# EAGLE schematic improved_circuit_rev5 (EAGLE 7.5.0)

## Sheet 1 of 7
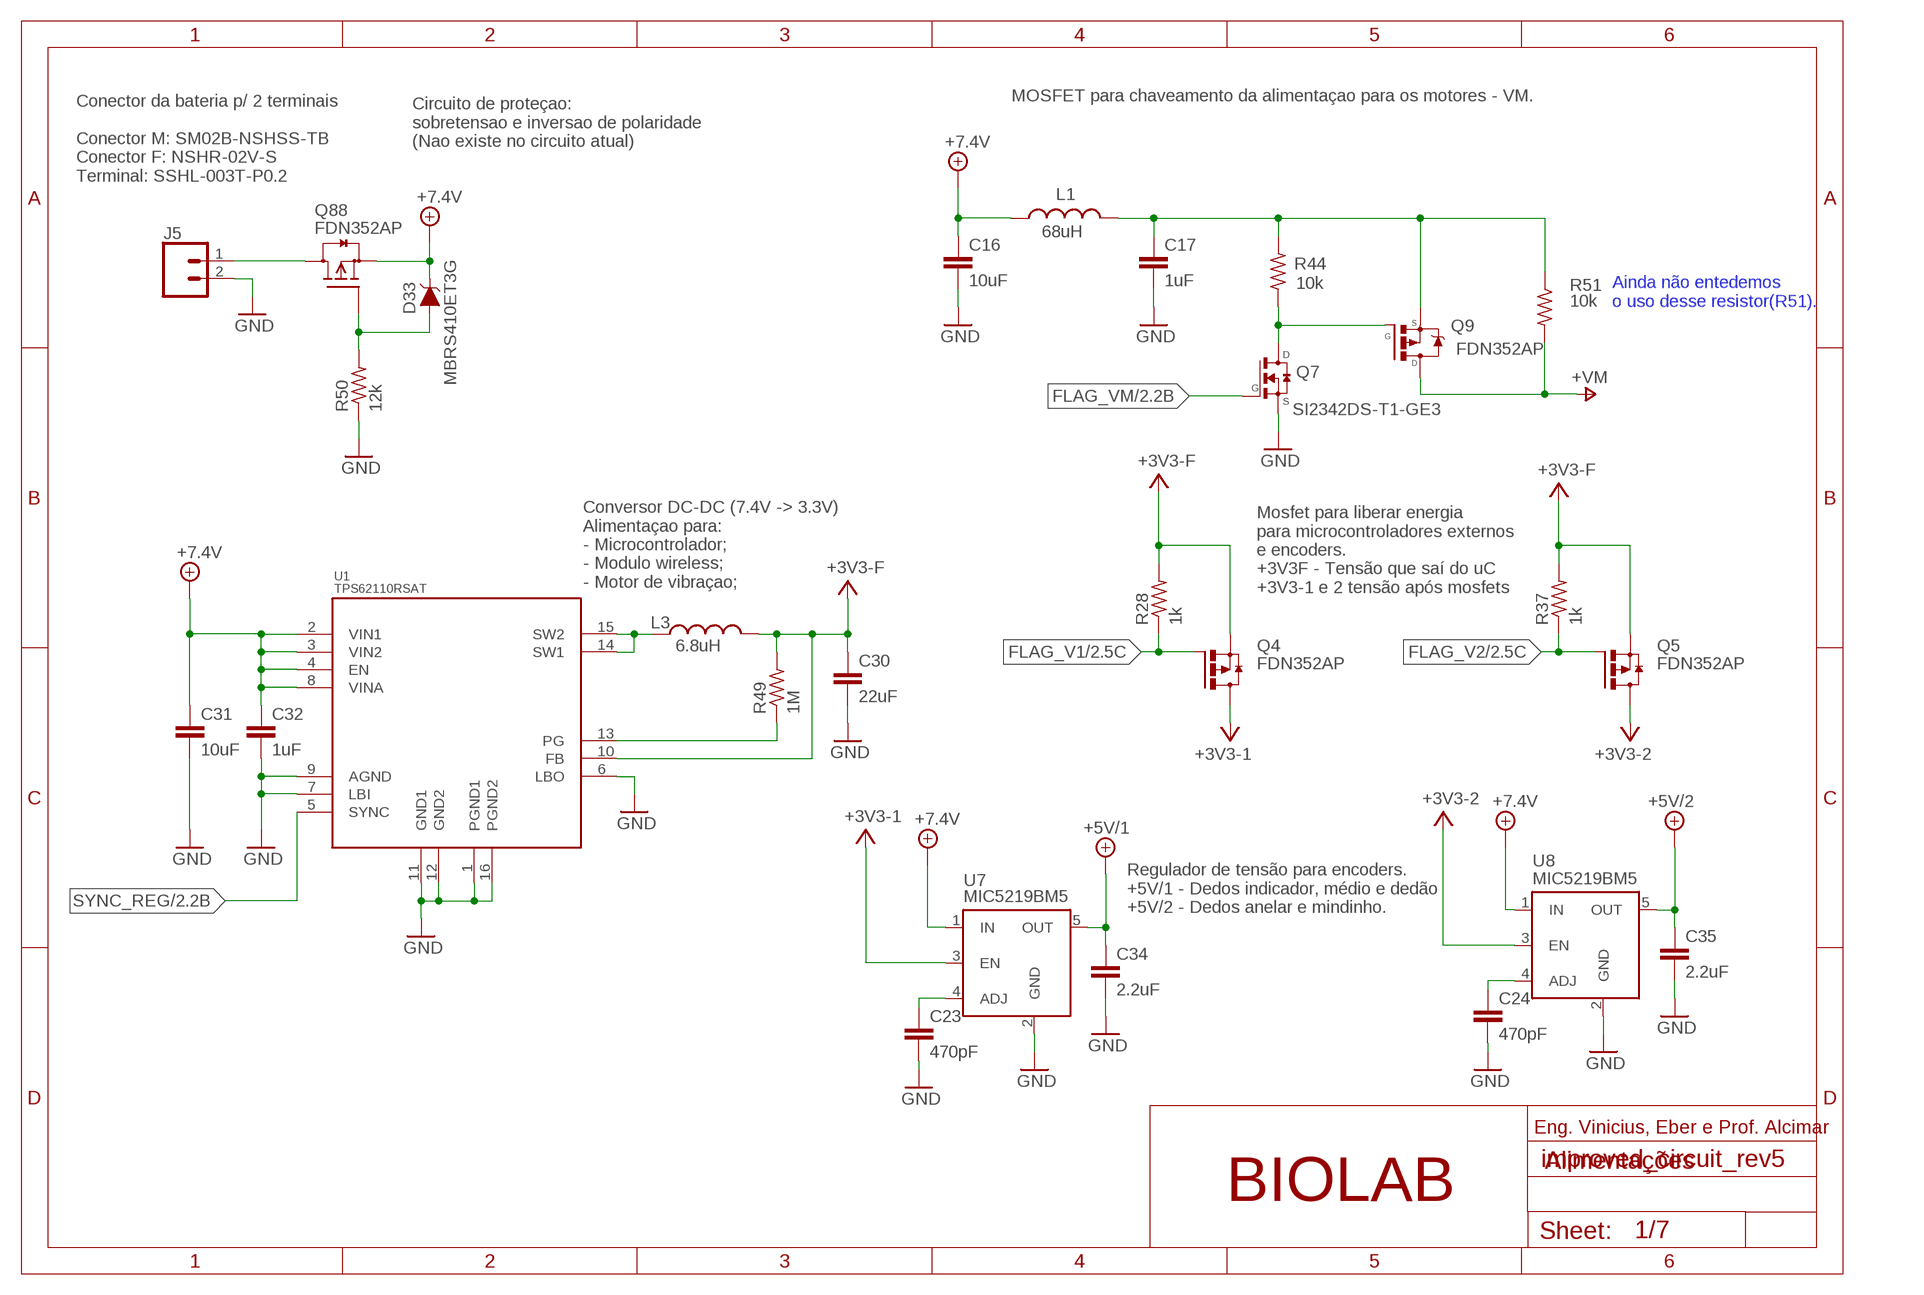
[diagram p0: schematic, sheet 1]

### Parts
C16  10uF  C-EUC0805  [C0805]
C17  1uF  C-EUC0805  [C0805]
C23  470pF  CAPACITOR_0805_M  [RESC0805_M]
C24  470pF  CAPACITOR_0805_M  [RESC0805_M]
C30  22uF  CAPACITOR_0805_M  [RESC0805_M]
C31  10uF  CAPACITOR_0805_M  [RESC0805_M]
C32  1uF  CAPACITOR_0805_M  [RESC0805_M]
C34  2.2uF  CAPACITOR_0805_M  [RESC0805_M]
C35  2.2uF  CAPACITOR_0805_M  [RESC0805_M]
D33  MBRS410ET3G  DIODE-ZENER-BZT52C3V6S  [SOD-323]
J5  CONN_02-JST-2MM-SMT  [JST-2-SMD]
L1  68uH  INDUCTOR  [L0603]
L3  6.8uH  INDUCTOR  [L0603]
Q4  FDN352AP  FDN360P  [SUPER-SOT3]
Q5  FDN352AP  FDN360P  [SUPER-SOT3]
Q7  SI2342DS-T1-GE3  FDV303N  [SOT23]
Q9  FDN352AP  FDS6675  [SO08-E3]
Q88  FDN352AP  BSS84LT1  [SOT23]
R28  1k  R-US_M0805  [M0805]
R37  1k  R-US_M0805  [M0805]
R44  10k  R-US_M0805  [M0805]
R49  1M  R-US_M0805  [M0805]
R50  12k  R-US_M0805  [M0805]
R51  10k  R-US_M0805  [M0805]
U1  TPS62110RSAT  [QFN16]
U7  MIC5219BM5  [SOT23-5]
U8  MIC5219BM5  [SOT23-5]

### Nets
+3V3: C30.1 L3.2 Q4.2(S) Q5.2(S) R28.2 R37.2 R49.2 U1.10(FB) U7.3(EN) U8.3(EN) ; supply symbol labelled +3V3-F, +3V3-1, +3V3-2 ; also sheet 2,3,5,6,7
+3V3-1: Q4.3(D) ; also sheet 4
+3V3-2: Q5.3(D) ; also sheet 4
+5V/1: C34.1 U7.5(OUT) ; also sheet 3,4
+5V/2: C35.1 U8.5(OUT) ; also sheet 4
+7V: C16.1 C31.1 C32.1 D33.C L1.1 Q88.2(S) U1.2(VIN1) U1.3(VIN2) U1.4(EN) U1.8(VINA) U7.1(IN) U8.1(IN) ; supply symbol labelled +7.4V ; also sheet 2
FLAG_V1: Q4.1(G) R28.1 ; also sheet 2
FLAG_V2: Q5.1(G) R37.1 ; also sheet 2
FLAG_VM: Q7.1(G) ; also sheet 2
GND: C16.2 C17.2 C23.2 C24.2 C30.2 C31.2 C32.2 C34.2 C35.2 J5.2 Q7.2(S) R50.1 U1.1(PGND1) U1.6(LBO) U1.7(LBI) U1.9(AGND) U1.11(GND1) U1.12(GND2) U1.16(PGND2) U7.2(GND) U8.2(GND) ; also sheet 2,3,4,5,6,7
N$9: C17.1 L1.2 Q9.1-3(S) R44.2 R51.1
N$10: Q7.3(D) Q9.4(G) R44.1
N$11: C24.1 U8.4(ADJ)
N$12: C23.1 U7.4(ADJ)
N$14: L3.1 U1.14(SW1) U1.15(SW2)
N$15: R49.1 U1.13(PG)
N$16: D33.A Q88.1(G) R50.2
N$18: J5.1 Q88.3(D)
SYNC_REG: U1.5(SYNC) ; also sheet 2
V+: Q9.5-8(D) R51.2 ; supply symbol labelled +VM ; also sheet 3,4,5

### Notes on the sheet
- MOSFET para chaveamento da alimentaçao para os motores - VM.
- Circuito de proteçao: 
  sobretensao e inversao de polaridade
  (Nao existe no circuito atual)
- Conector da bateria p/ 2 terminais
  
  Conector M: SM02B-NSHSS-TB
  Conector F: NSHR-02V-S
  Terminal: SSHL-003T-P0.2
- Ainda não entedemos 
  o uso desse resistor(R51).
- Conversor DC-DC (7.4V -> 3.3V) 
  Alimentaçao para:
  - Microcontrolador;
  - Modulo wireless;
  - Motor de vibraçao;
- Mosfet para liberar energia 
  para microcontroladores externos
  e encoders.
  +3V3F - Tensão que saí do uC
  +3V3-1 e 2 tensão após mosfets
- Regulador de tensão para encoders.
  +5V/1 - Dedos indicador, médio e dedão
  +5V/2 - Dedos anelar e mindinho.
- Eng. Vinicius, Eber e Prof. Alcimar
- Alimentações
- BIOLAB

## Sheet 2 of 7
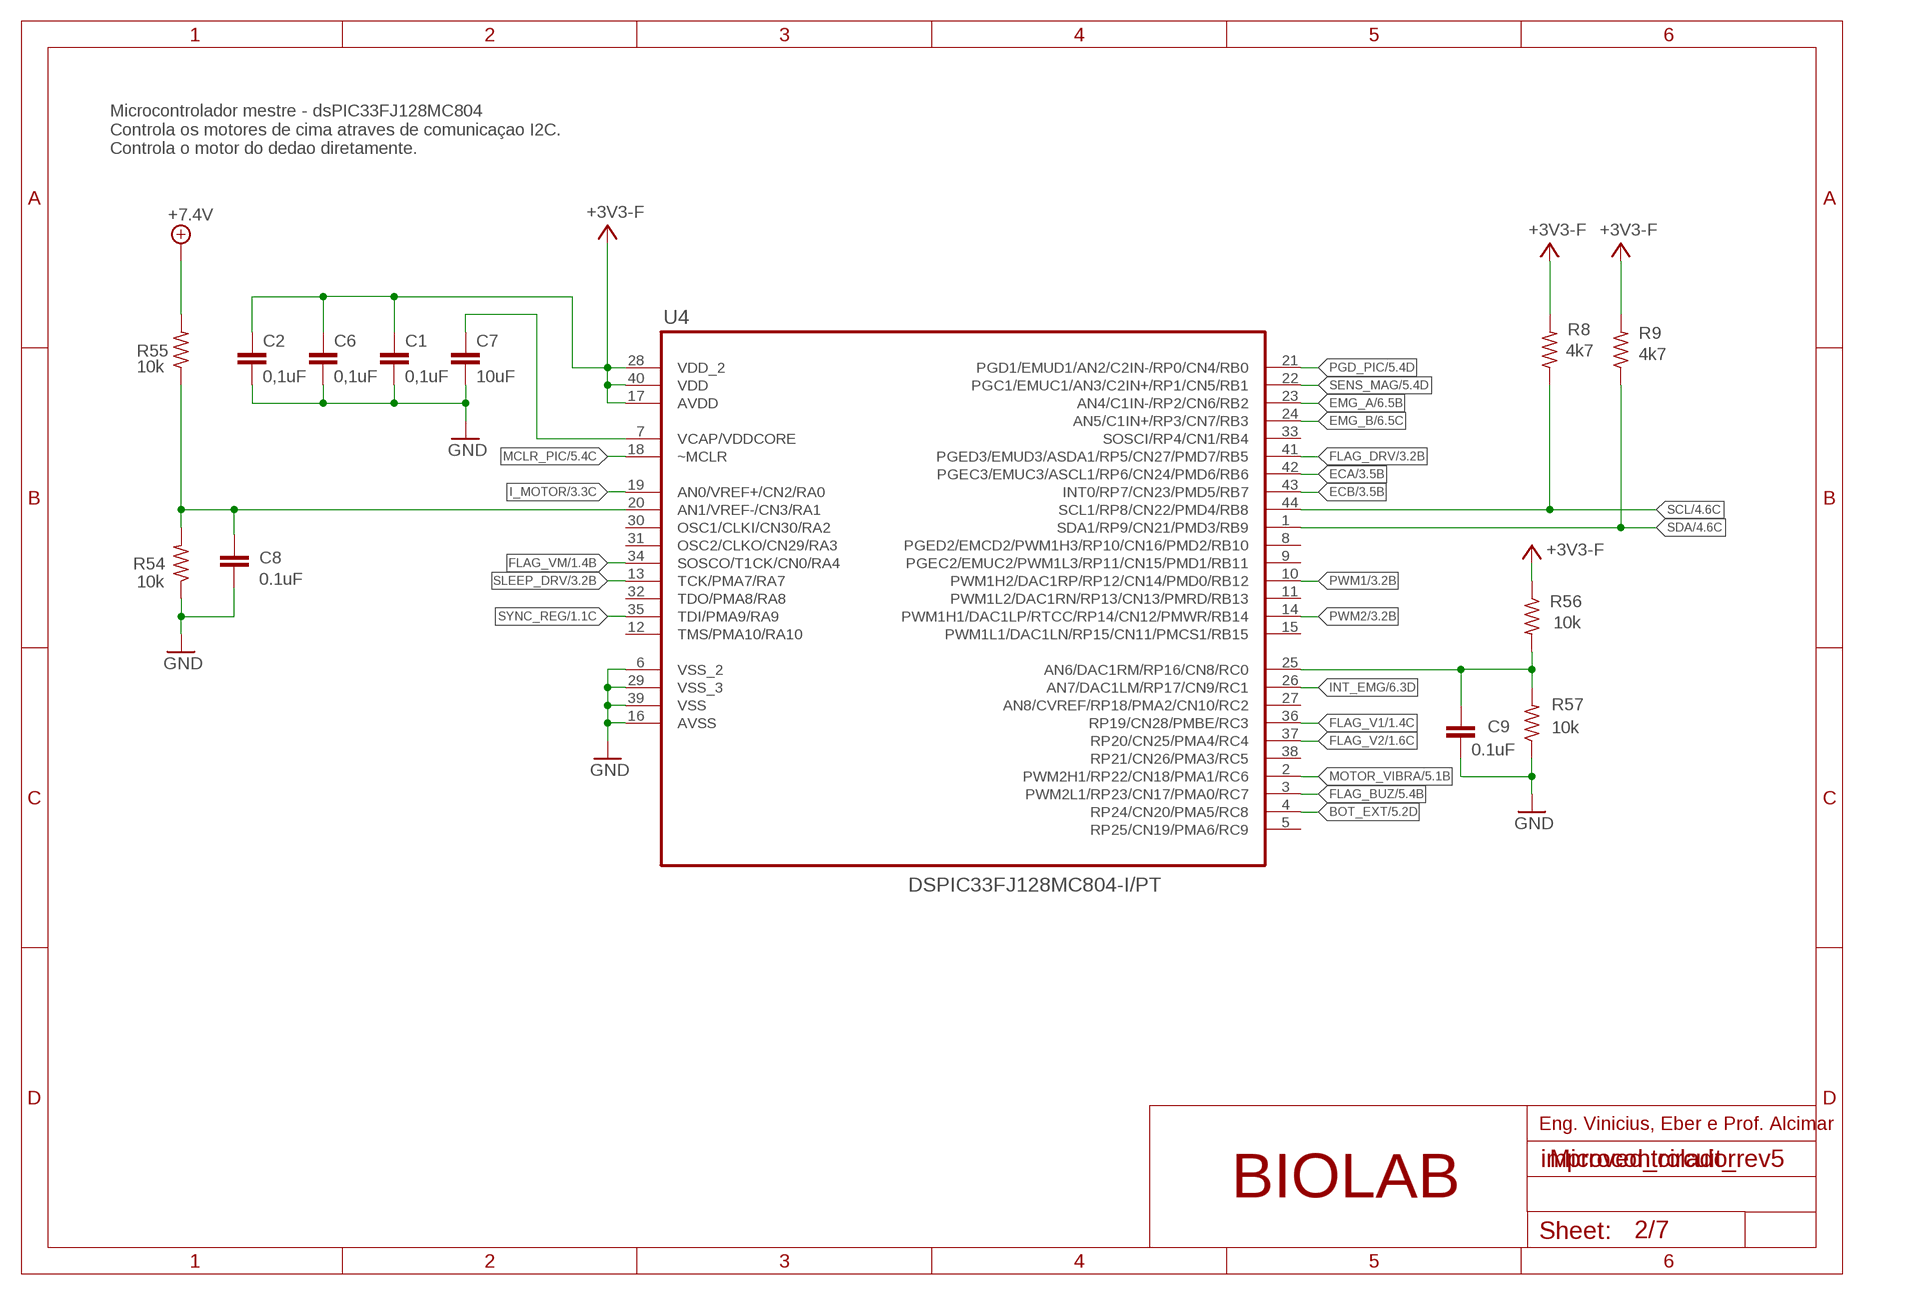
[diagram p1: schematic, sheet 2]

### Parts
C1  0,1uF  CAPACITOR_0805_M  [RESC0805_M]
C2  0,1uF  CAPACITOR_0805_M  [RESC0805_M]
C6  0,1uF  CAPACITOR_0805_M  [RESC0805_M]
C7  10uF  CAPACITOR_0805_M  [RESC0805_M]
C8  0.1uF  CAPACITOR_0805_M  [RESC0805_M]
C9  0.1uF  CAPACITOR_0805_M  [RESC0805_M]
R8  4k7  R-US_M0805  [M0805]
R9  4k7  R-US_M0805  [M0805]
R54  10k  R-US_M0805  [M0805]
R55  10k  R-US_M0805  [M0805]
R56  10k  R-US_M0805  [M0805]
R57  10k  R-US_M0805  [M0805]
U4  DSPIC33FJ128MC804-I/PT  [QFP80P1200X1200X120-44N]

### Nets
+3V3: C1.1 C2.1 C6.1 R8.2 R9.2 R56.1 U4.17(AVDD) U4.28(VDD_2) U4.40(VDD) ; supply symbol labelled +3V3-F ; also sheet 1,3,5,6,7
+7V: R55.2 ; supply symbol labelled +7.4V ; also sheet 1
BOT_EXT: U4.4(RP24/CN20/PMA5/RC8) ; also sheet 5
ECA: U4.42(PGEC3/EMUC3/ASCL1/RP6/CN24/PMD6/RB6) ; also sheet 3
ECB: U4.43(INT0/RP7/CN23/PMD5/RB7) ; also sheet 3
EMG_A: U4.23(AN4/C1IN-/RP2/CN6/RB2) ; also sheet 6
EMG_B: U4.24(AN5/C1IN+/RP3/CN7/RB3) ; also sheet 6
FLAG_BUZ: U4.3(PWM2L1/RP23/CN17/PMA0/RC7) ; also sheet 5
FLAG_DRV: U4.41(PGED3/EMUD3/ASDA1/RP5/CN27/PMD7/RB5) ; also sheet 3
FLAG_V1: U4.36(RP19/CN28/PMBE/RC3) ; also sheet 1
FLAG_V2: U4.37(RP20/CN25/PMA4/RC4) ; also sheet 1
FLAG_VM: U4.34(SOSCO/T1CK/CN0/RA4) ; also sheet 1
GND: C1.2 C2.2 C6.2 C7.2 C8.2 C9.2 R54.1 R57.1 U4.6(VSS_2) U4.16(AVSS) U4.29(VSS_3) U4.39(VSS) ; also sheet 1,3,4,5,6,7
I_MOTOR: U4.19(AN0/VREF+/CN2/RA0) ; also sheet 3
INT_EMG: U4.26(AN7/DAC1LM/RP17/CN9/RC1) ; also sheet 6
MCLR_PIC: U4.18(~MCLR) ; also sheet 5
MOTOR_VIBRA: U4.2(PWM2H1/RP22/CN18/PMA1/RC6) ; also sheet 5
N$3: C7.1 U4.7(VCAP/VDDCORE)
N$4: C9.1 R56.2 R57.2 U4.25(AN6/DAC1RM/RP16/CN8/RC0)
N$19: C8.1 R54.2 R55.1 U4.20(AN1/VREF-/CN3/RA1)
PGD_PIC: U4.21(PGD1/EMUD1/AN2/C2IN-/RP0/CN4/RB0) ; also sheet 5
PWM1: U4.10(PWM1H2/DAC1RP/RP12/CN14/PMD0/RB12) ; also sheet 3
PWM2: U4.14(PWM1H1/DAC1LP/RTCC/RP14/CN12/PMWR/RB14) ; also sheet 3
SCL: R8.1 U4.44(SCL1/RP8/CN22/PMD4/RB8) ; also sheet 4,6
SDA: R9.1 U4.1(SDA1/RP9/CN21/PMD3/RB9) ; also sheet 4,6
SENS_MAG: U4.22(PGC1/EMUC1/AN3/C2IN+/RP1/CN5/RB1) ; also sheet 5
SLEEP_DRV: U4.13(TCK/PMA7/RA7) ; also sheet 3
SYNC_REG: U4.35(TDI/PMA9/RA9) ; also sheet 1
Unconnected: U4.5(RP25/CN19/PMA6/RC9) U4.8(PGED2/EMCD2/PWM1H3/RP10/CN16/PMD2/RB10) U4.9(PGEC2/EMUC2/PWM1L3/RP11/CN15/PMD1/RB11) U4.11(PWM1L2/DAC1RN/RP13/CN13/PMRD/RB13) U4.12(TMS/PMA10/RA10) U4.15(PWM1L1/DAC1LN/RP15/CN11/PMCS1/RB15) U4.27(AN8/CVREF/RP18/PMA2/CN10/RC2) U4.30(OSC1/CLKI/CN30/RA2) U4.31(OSC2/CLKO/CN29/RA3) U4.32(TDO/PMA8/RA8) U4.33(SOSCI/RP4/CN1/RB4) U4.38(RP21/CN26/PMA3/RC5)

### Notes on the sheet
- Microcontrolador mestre - dsPIC33FJ128MC804
  Controla os motores de cima atraves de comunicaçao I2C.
  Controla o motor do dedao diretamente.
- Eng. Vinicius, Eber e Prof. Alcimar
- Microcontrolador
- BIOLAB

## Sheet 3 of 7
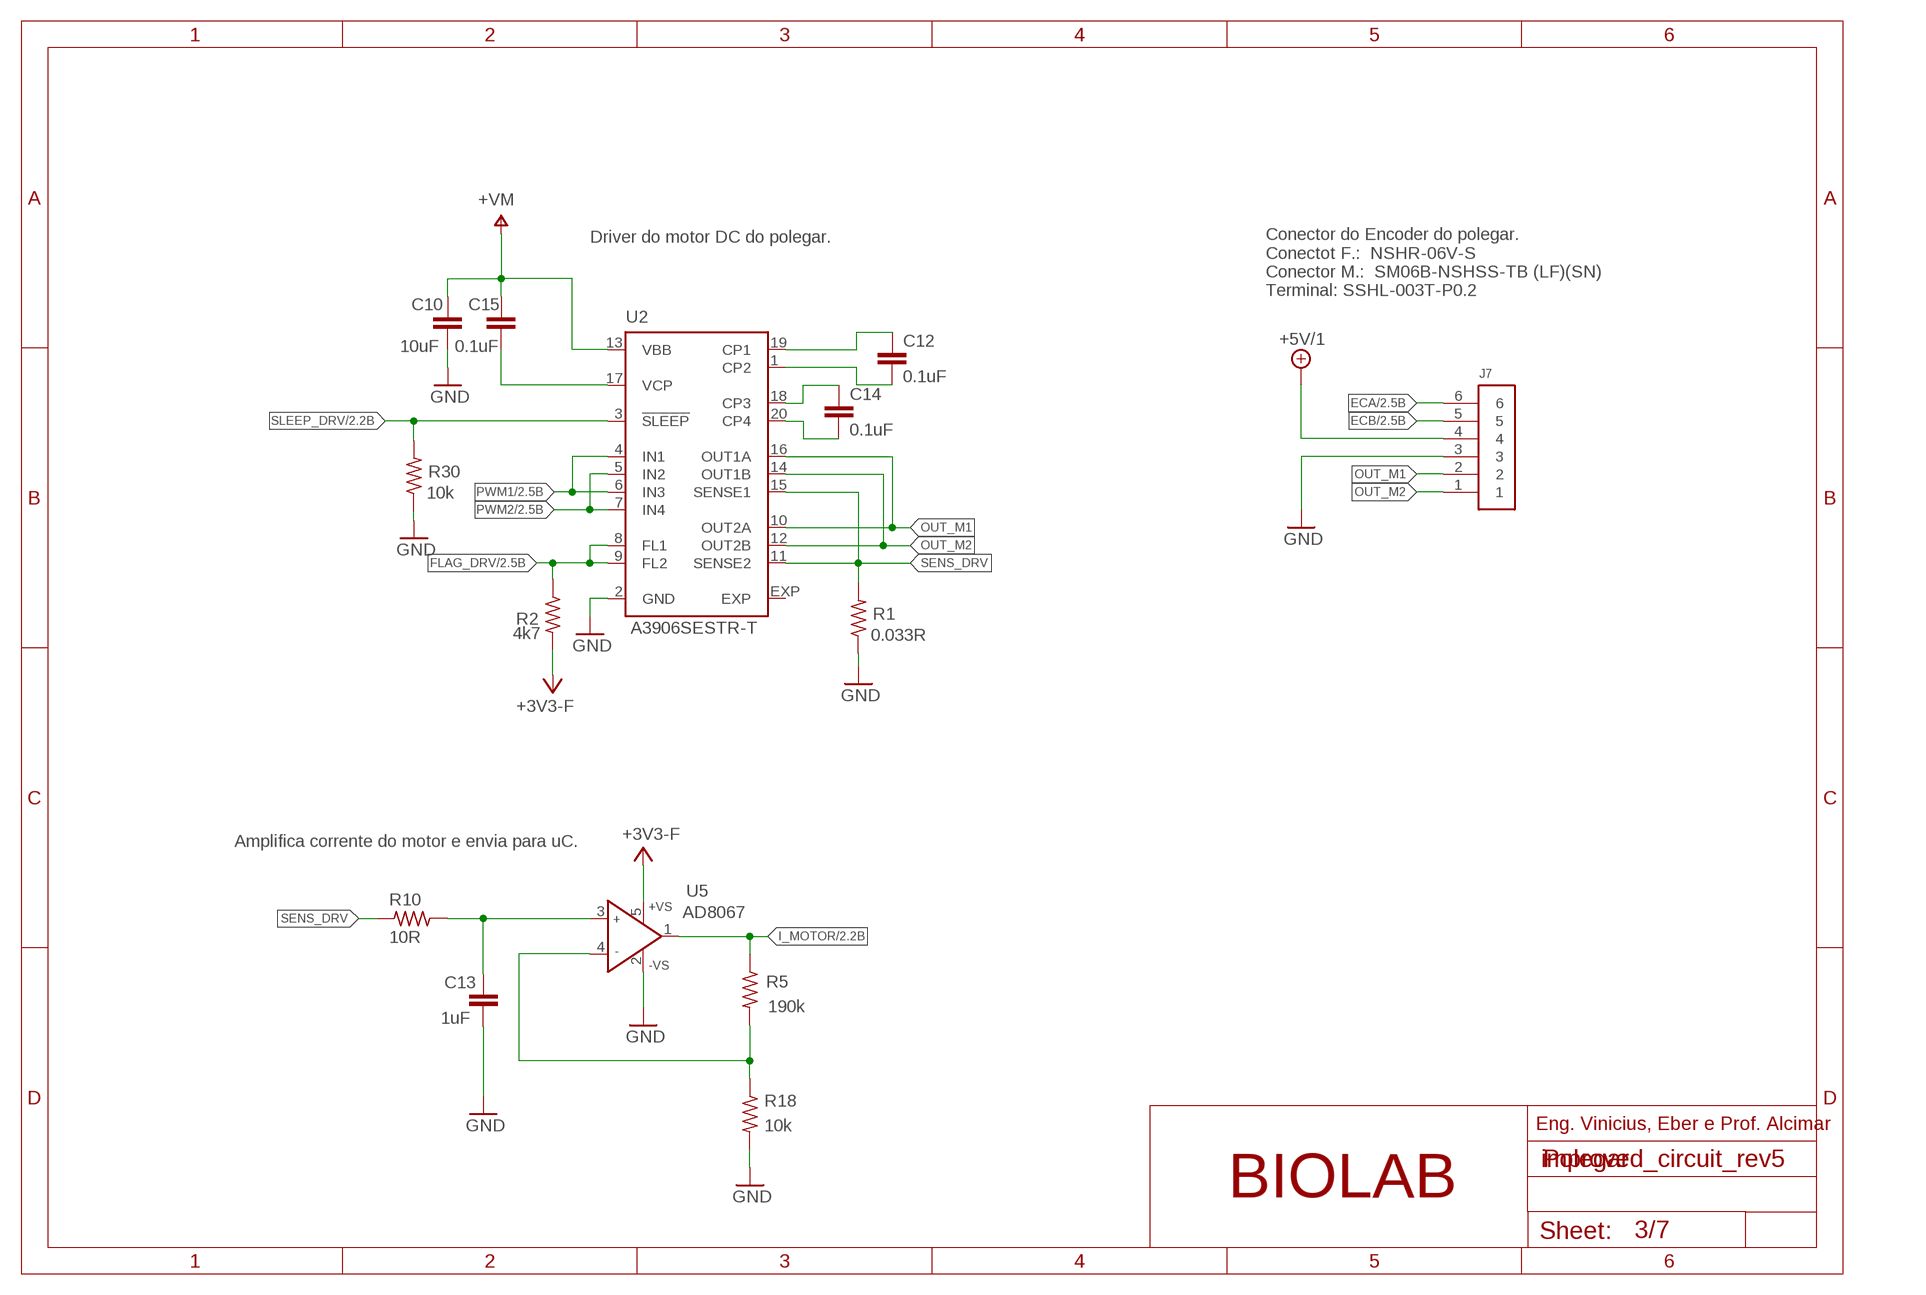
[diagram p2: schematic, sheet 3]

### Parts
C10  10uF  CAPACITOR_0805_M  [RESC0805_M]
C12  0.1uF  CAPACITOR_0805_M  [RESC0805_M]
C13  1uF  CAPACITOR_0805_M  [RESC0805_M]
C14  0.1uF  CAPACITOR_0805_M  [RESC0805_M]
C15  0.1uF  CAPACITOR_0805_M  [RESC0805_M]
J7  61300611121  [61300611121]
R1  0.033R  R-US_M0805  [M0805]
R2  4k7  R-US_M0805  [M0805]
R5  190k  R-US_R0805  [R0805]
R10  10R  R-US_R0805  [R0805]
R18  10k  R-US_R0805  [R0805]
R30  10k  R-US_M0805  [M0805]
U2  A3906SESTR-T  A3906  [QFN20]
U5  AD8067  [SOT23-5]

### Nets
+3V3: R2.2 U5.5(+VS) ; supply symbol labelled +3V3-F ; also sheet 1,2,5,6,7
+5V/1: J7.4 ; also sheet 1,4
ECA: J7.6 ; also sheet 2
ECB: J7.5 ; also sheet 2
FLAG_DRV: R2.1 U2.8(FL1) U2.9(FL2) ; also sheet 2
GND: C10.1 C13.2 J7.3 R1.1 R18.2 R30.1 U2.2(GND) U5.2(-VS) ; also sheet 1,2,4,5,6,7
I_MOTOR: R5.1 U5.1(OUT) ; also sheet 2
N$8: C13.1 R10.1 U5.3(IN+)
N$13: C12.2 U2.1(CP2)
N$17: C14.1 U2.18(CP3)
N$20: C15.2 U2.17(VCP)
N$21: C14.2 U2.20(CP4)
N$25: C12.1 U2.19(CP1)
N$26: R5.2 R18.1 U5.4(IN-)
OUT_M1: J7.2 U2.10(OUT2A) U2.16(OUT1A)
OUT_M2: J7.1 U2.12(OUT2B) U2.14(OUT1B)
PWM1: U2.4(IN1) U2.6(IN3) ; also sheet 2
PWM2: U2.5(IN2) U2.7(IN4) ; also sheet 2
SENS_DRV: R1.2 R10.2 U2.11(SENSE2) U2.15(SENSE1)
SLEEP_DRV: R30.2 U2.3(!SLEEP) ; also sheet 2
V+: C10.2 C15.1 U2.13(VBB) ; supply symbol labelled +VM ; also sheet 1,4,5
Unconnected: U2.EXP

### Notes on the sheet
- Driver do motor DC do polegar.
- Conector do Encoder do polegar.
  Conectot F.:  NSHR-06V-S 
  Conector M.:  SM06B-NSHSS-TB (LF)(SN) 
  Terminal: SSHL-003T-P0.2
- Amplifica corrente do motor e envia para uC.
- Eng. Vinicius, Eber e Prof. Alcimar
- Polegar
- BIOLAB

## Sheet 4 of 7
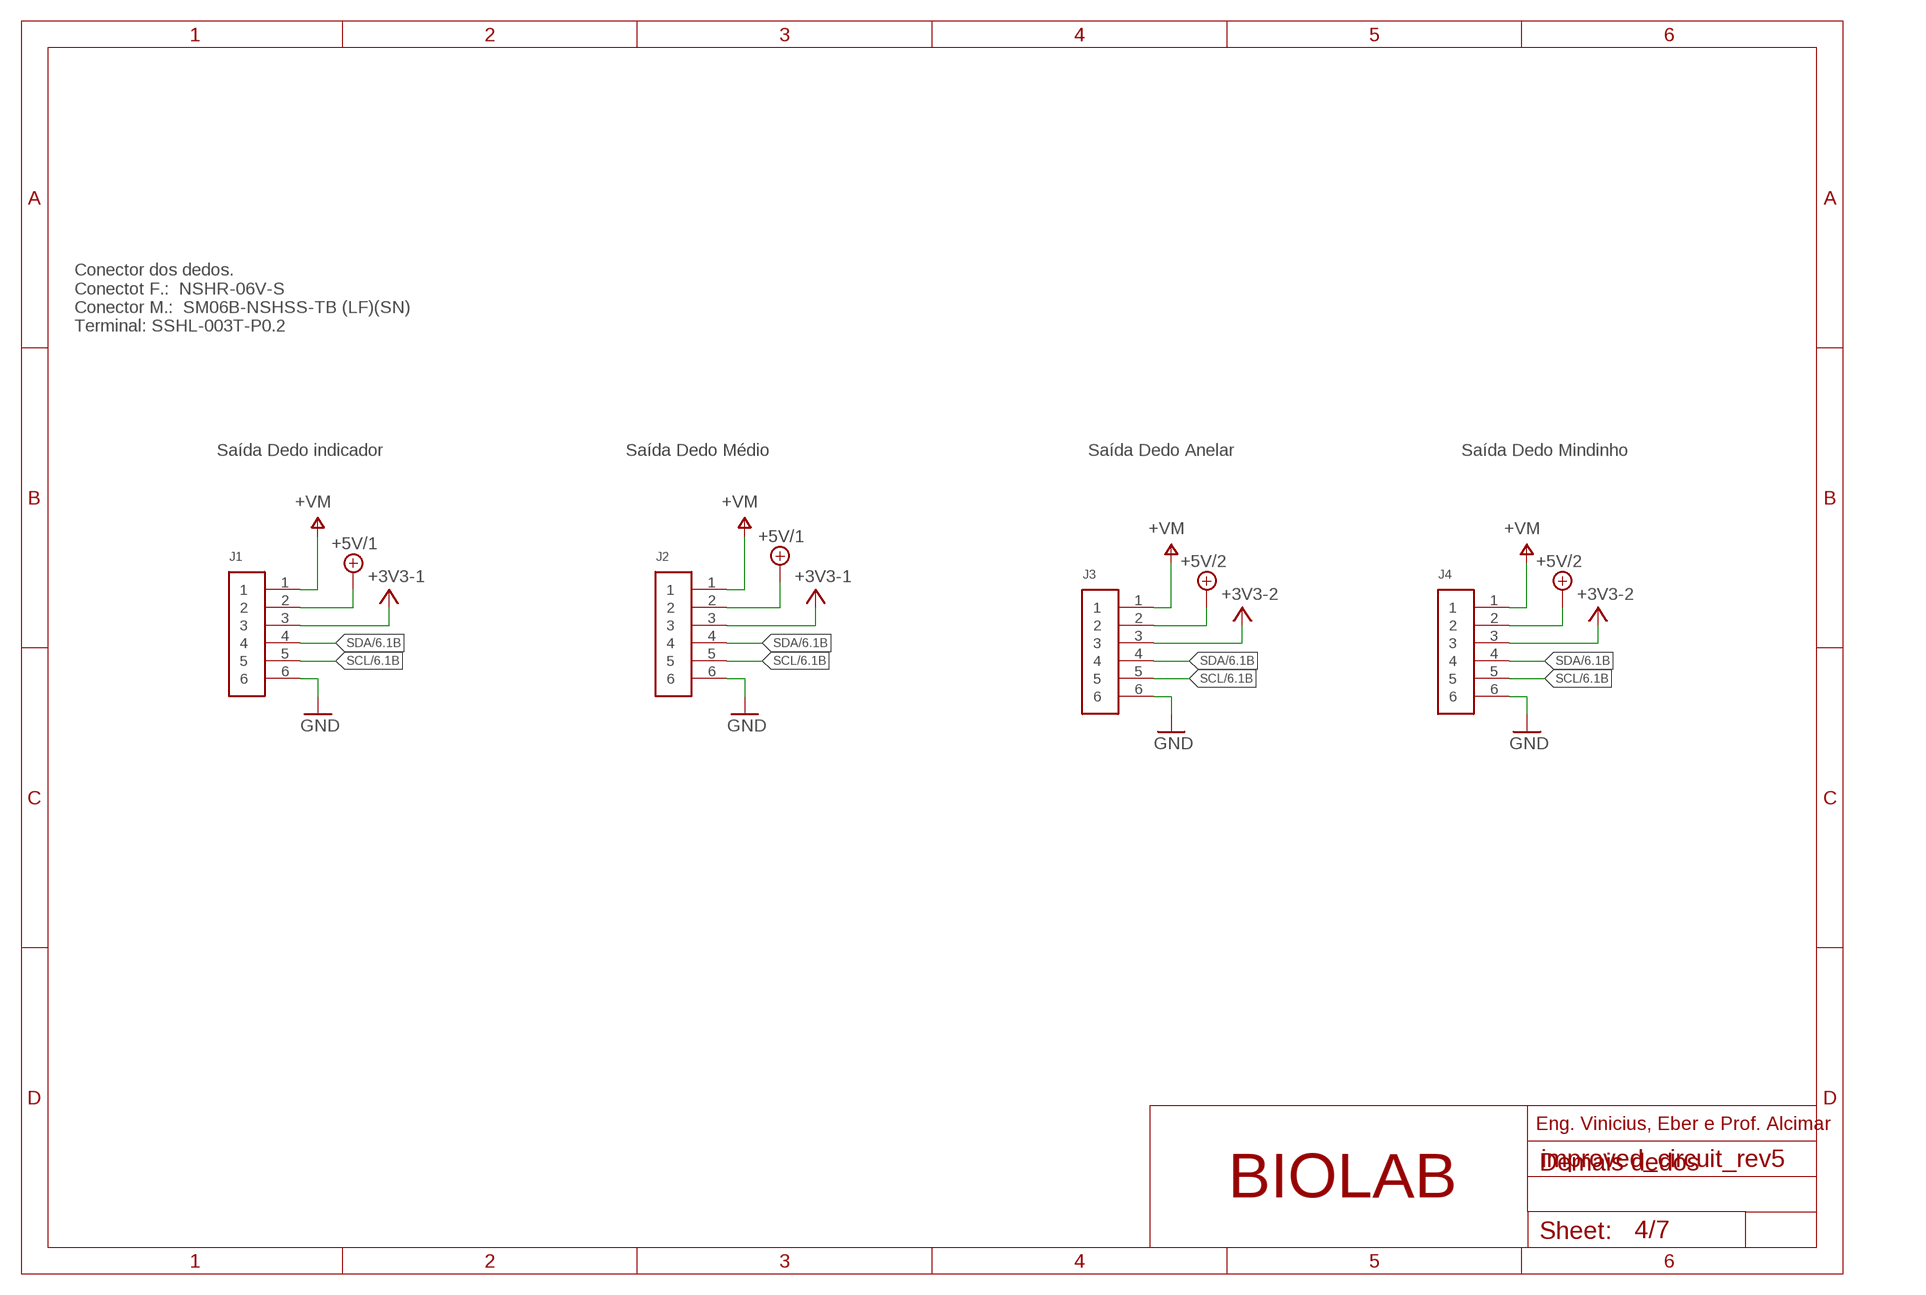
[diagram p3: schematic, sheet 4]

### Parts
J1  61300611121  [61300611121]
J2  61300611121  [61300611121]
J3  61300611121  [61300611121]
J4  61300611121  [61300611121]

### Nets
+3V3-1: J1.3 J2.3 ; also sheet 1
+3V3-2: J3.3 J4.3 ; also sheet 1
+5V/1: J1.2 J2.2 ; also sheet 1,3
+5V/2: J3.2 J4.2 ; also sheet 1
GND: J1.6 J2.6 J3.6 J4.6 ; also sheet 1,2,3,5,6,7
SCL: J1.5 J2.5 J3.5 J4.5 ; also sheet 2,6
SDA: J1.4 J2.4 J3.4 J4.4 ; also sheet 2,6
V+: J1.1 J2.1 J3.1 J4.1 ; supply symbol labelled +VM ; also sheet 1,3,5

### Notes on the sheet
- Conector dos dedos.
  Conectot F.:  NSHR-06V-S 
  Conector M.:  SM06B-NSHSS-TB (LF)(SN) 
  Terminal: SSHL-003T-P0.2
- Saída Dedo indicador | Saída Dedo Médio | Saída Dedo Anelar | Saída Dedo Mindinho
- Eng. Vinicius, Eber e Prof. Alcimar
- Demais dedos
- BIOLAB

## Sheet 5 of 7
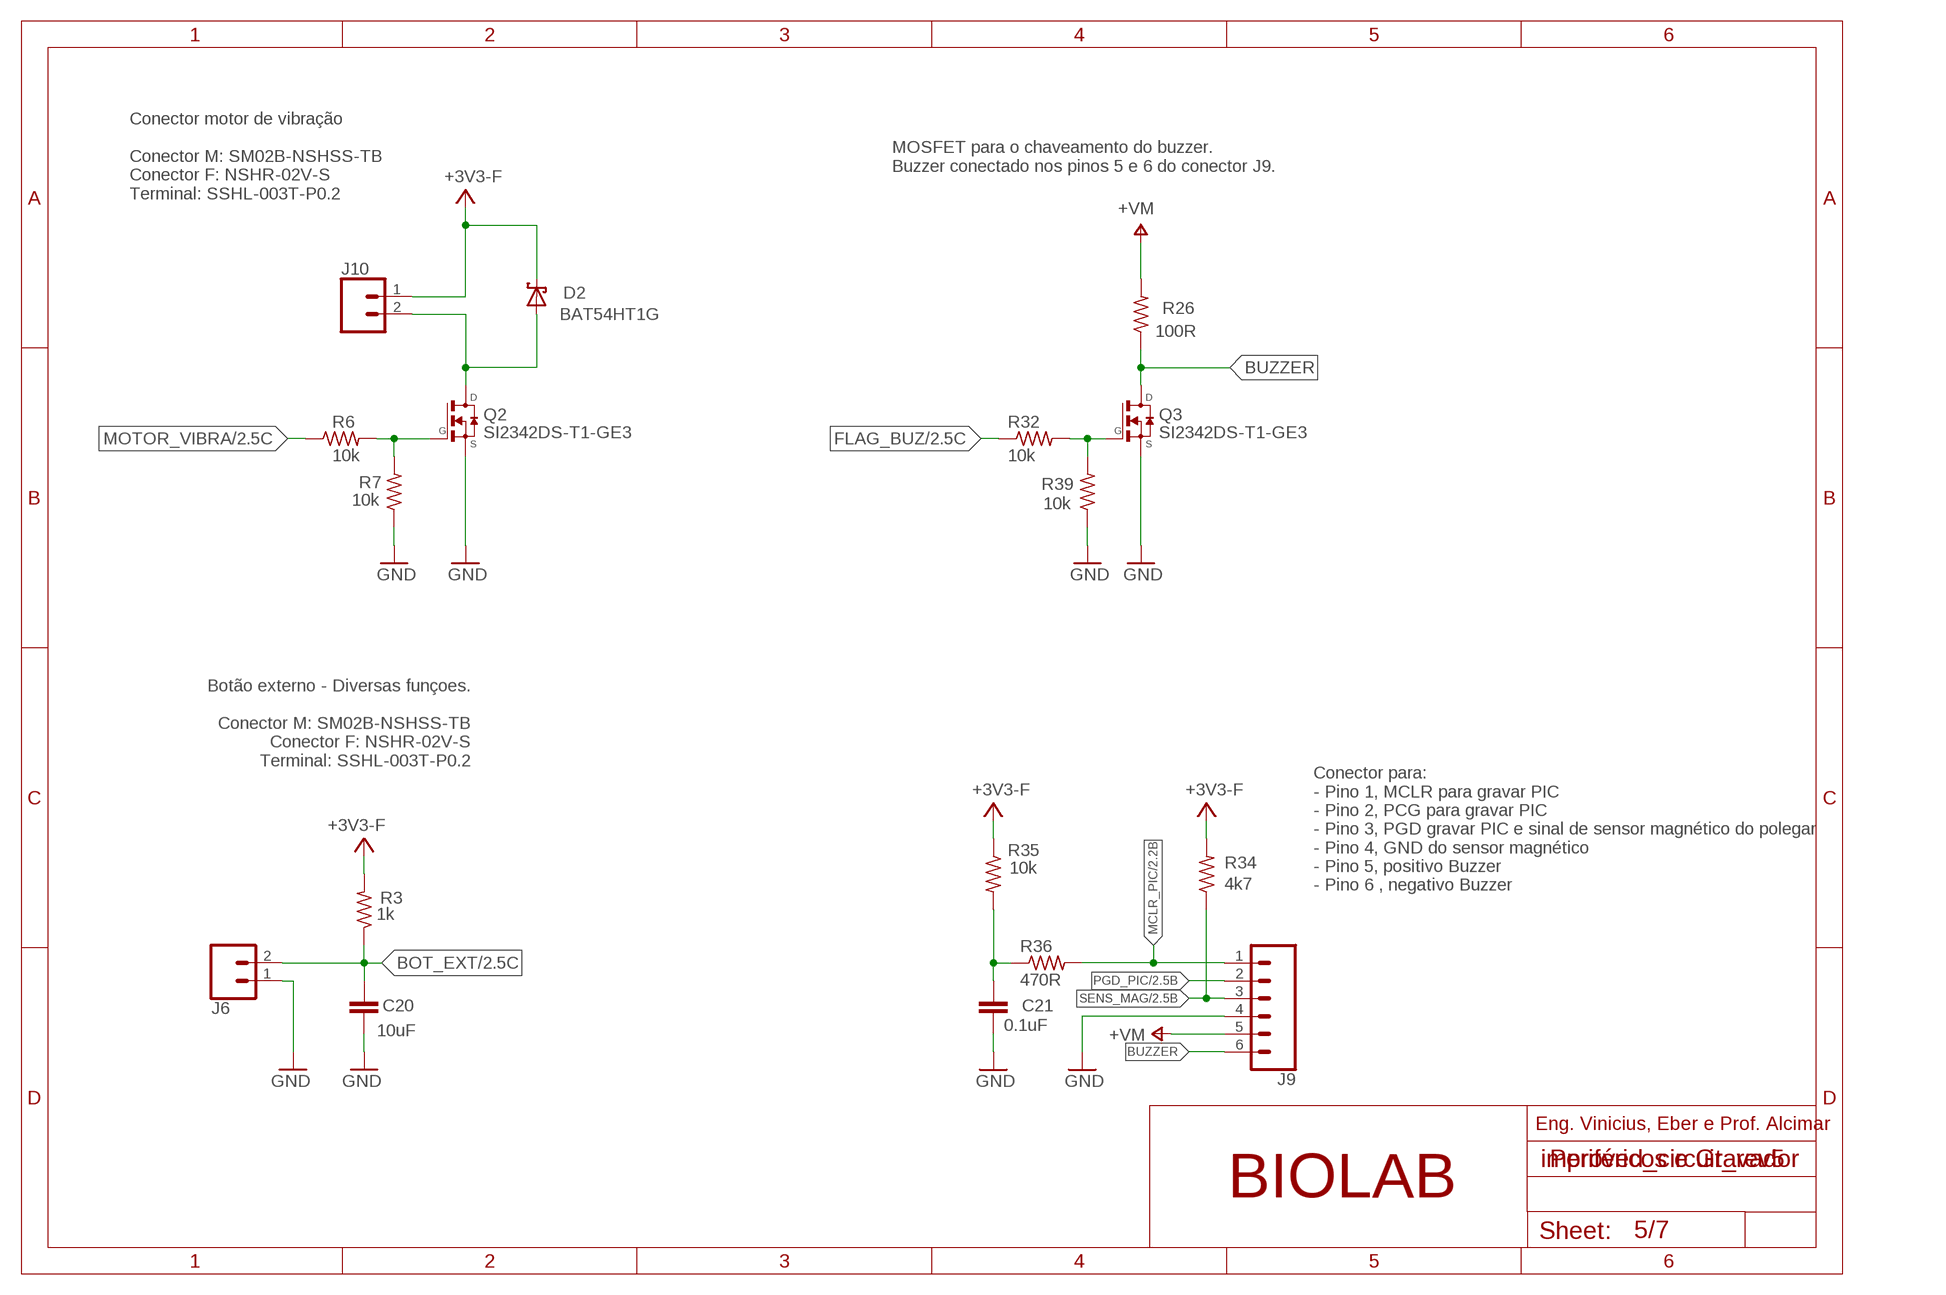
[diagram p4: schematic, sheet 5]

### Parts
C20  10uF  CAPACITOR_0805_M  [RESC0805_M]
C21  0.1uF  CAPACITOR_0805_M  [RESC0805_M]
D2  BAT54HT1G  BAS70W,115  [SOT323]
J6  CONN_02-JST-2MM-SMT  [JST-2-SMD]
J9  CONN_06SMD-1MM  [1X06-1MM]
J10  CONN_02-JST-2MM-SMT  [JST-2-SMD]
Q2  SI2342DS-T1-GE3  FDV303N  [SOT23]
Q3  SI2342DS-T1-GE3  FDV303N  [SOT23]
R3  1k  R-US_M0805  [M0805]
R6  10k  R-US_M0805  [M0805]
R7  10k  R-US_M0805  [M0805]
R26  100R  R-US_M0805  [M0805]
R32  10k  R-US_M0805  [M0805]
R34  4k7  R-US_M0805  [M0805]
R35  10k  R-US_M0805  [M0805]
R36  470R  R-US_M0805  [M0805]
R39  10k  R-US_M0805  [M0805]

### Nets
+3V3: D2.3(K) J10.1 R3.2 R34.2 R35.1 ; supply symbol labelled +3V3-F ; also sheet 1,2,3,6,7
BOT_EXT: C20.1 J6.2 R3.1 ; also sheet 2
BUZZER: J9.6 Q3.3(D) R26.1
FLAG_BUZ: R32.1 ; also sheet 2
GND: C20.2 C21.2 J6.1 J9.4 Q2.2(S) Q3.2(S) R7.1 R39.1 ; also sheet 1,2,3,4,6,7
MCLR_PIC: J9.1 R36.2 ; also sheet 2
MOTOR_VIBRA: R6.1 ; also sheet 2
N$6: Q2.1(G) R6.2 R7.2
N$24: C21.1 R35.2 R36.1
N$28: D2.1(A) J10.2 Q2.3(D)
N$29: Q3.1(G) R32.2 R39.2
PGD_PIC: J9.2 ; also sheet 2
SENS_MAG: J9.3 R34.1 ; also sheet 2
V+: J9.5 R26.2 ; supply symbol labelled +VM ; also sheet 1,3,4

### Notes on the sheet
- MOSFET para o chaveamento do buzzer.
  Buzzer conectado nos pinos 5 e 6 do conector J9.
- Conector motor de vibração
  
  Conector M: SM02B-NSHSS-TB
  Conector F: NSHR-02V-S
  Terminal: SSHL-003T-P0.2
- Botão externo - Diversas funçoes.
  
  Conector M: SM02B-NSHSS-TB
  Conector F: NSHR-02V-S
  Terminal: SSHL-003T-P0.2
- Conector para:
  - Pino 1, MCLR para gravar PIC
  - Pino 2, PCG para gravar PIC
  - Pino 3, PGD gravar PIC e sinal de sensor magnético do polegar
  - Pino 4, GND do sensor magnético
  - Pino 5, positivo Buzzer
  - Pino 6 , negativo Buzzer
- Eng. Vinicius, Eber e Prof. Alcimar
- Periféricos e Gravador
- BIOLAB

## Sheet 6 of 7
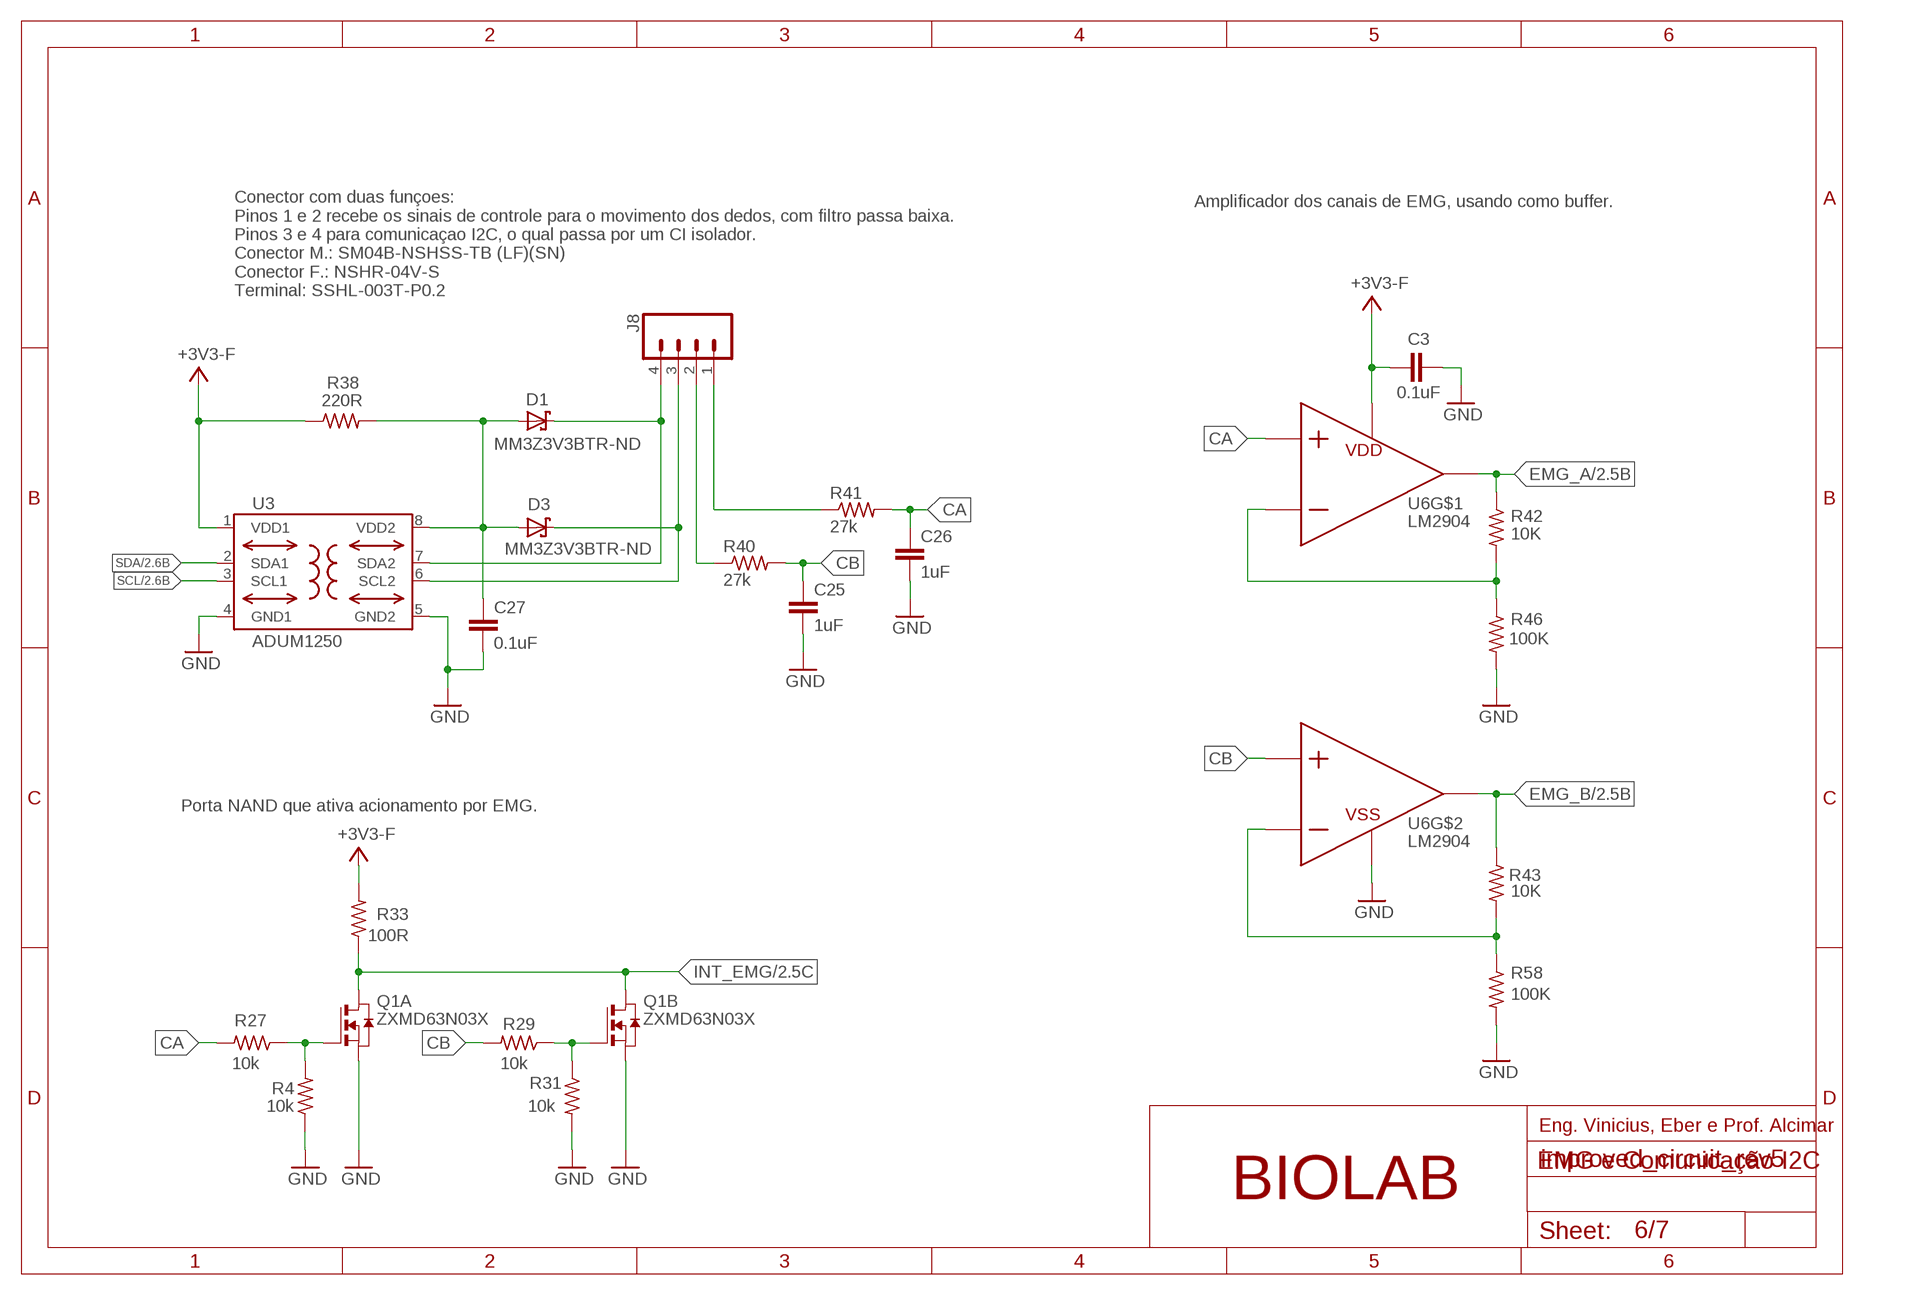
[diagram p5: schematic, sheet 6]

### Parts
C3  0.1uF  CAPACITOR_0805_M  [RESC0805_M]
C25  1uF  CAPACITOR_0805_M  [RESC0805_M]
C26  1uF  CAPACITOR_0805_M  [RESC0805_M]
C27  0.1uF  CAPACITOR_0805_M  [RESC0805_M]
D1  MM3Z3V3BTR-ND  BAT60J  [SOD323_ST]
D3  MM3Z3V3BTR-ND  BAT60J  [SOD323_ST]
J8  CONN_04SMD2  [1X04_1MM_RA]
Q1  ZXMD63N03X  [MSOP8]
R4  10k  R-US_M0805  [M0805]
R27  10k  R-US_M0805  [M0805]
R29  10k  R-US_M0805  [M0805]
R31  10k  R-US_M0805  [M0805]
R33  100R  R-US_M0805  [M0805]
R38  220R  R-US_M0805  [M0805]
R40  27k  R-US_M0805  [M0805]
R41  27k  R-US_M0805  [M0805]
R42  10K  R-US_M0805  [M0805]
R43  10K  R-US_M0805  [M0805]
R46  100K  R-US_M0805  [M0805]
R58  100K  R-US_M0805  [M0805]
U3  ADUM1250  [SO8-COOL]
U6  LM2904  LM2902  [TSSOP8]

### Nets
+3V3: C3.1 R33.2 R38.1 U3.1(VDD1) U6.8(VDD) ; supply symbol labelled +3V3-F ; also sheet 1,2,3,5,7
CA: C26.1 R27.2 R41.2 U6.3(P)
CB: C25.1 R29.2 R40.2 U6.5(P1)
EMG_A: R42.1 U6.1(VOUT) ; also sheet 2
EMG_B: R43.1 U6.7(VOUT1) ; also sheet 2
GND: C3.2 C25.2 C26.2 C27.2 Q1.1(A:S) Q1.3(B:S) R4.1 R31.2 R46.2 R58.2 U3.4(GND1) U3.5(GND2) U6.4(VSS) ; also sheet 1,2,3,4,5,7
INT_EMG: Q1.5(B:D) Q1.6(B:D) Q1.7(A:D) Q1.8(A:D) R33.1 ; also sheet 2
N$5: Q1.2(A:G) R4.2 R27.1
N$7: Q1.4(B:G) R29.1 R31.1
N$27: D1.C J8.4 U3.7(SDA2)
N$30: R42.2 R46.1 U6.2(N)
N$31: R43.2 R58.1 U6.6(N1)
N$32: D3.C J8.3 U3.6(SCL2)
N$33: J8.2 R40.1
N$34: J8.1 R41.1
N$39: C27.1 D1.A D3.A R38.2 U3.8(VDD2)
SCL: U3.3(SCL1) ; also sheet 2,4
SDA: U3.2(SDA1) ; also sheet 2,4

### Notes on the sheet
- Amplificador dos canais de EMG, usando como buffer.
- Conector com duas funçoes:
  Pinos 1 e 2 recebe os sinais de controle para o movimento dos dedos, com filtro passa baixa.
  Pinos 3 e 4 para comunicaçao I2C, o qual passa por um CI isolador.
  Conector M.: SM04B-NSHSS-TB (LF)(SN)
  Conector F.: NSHR-04V-S
  Terminal: SSHL-003T-P0.2
- Porta NAND que ativa acionamento por EMG.
- Eng. Vinicius, Eber e Prof. Alcimar
- EMG e Comunicação I2C
- BIOLAB

## Sheet 7 of 7
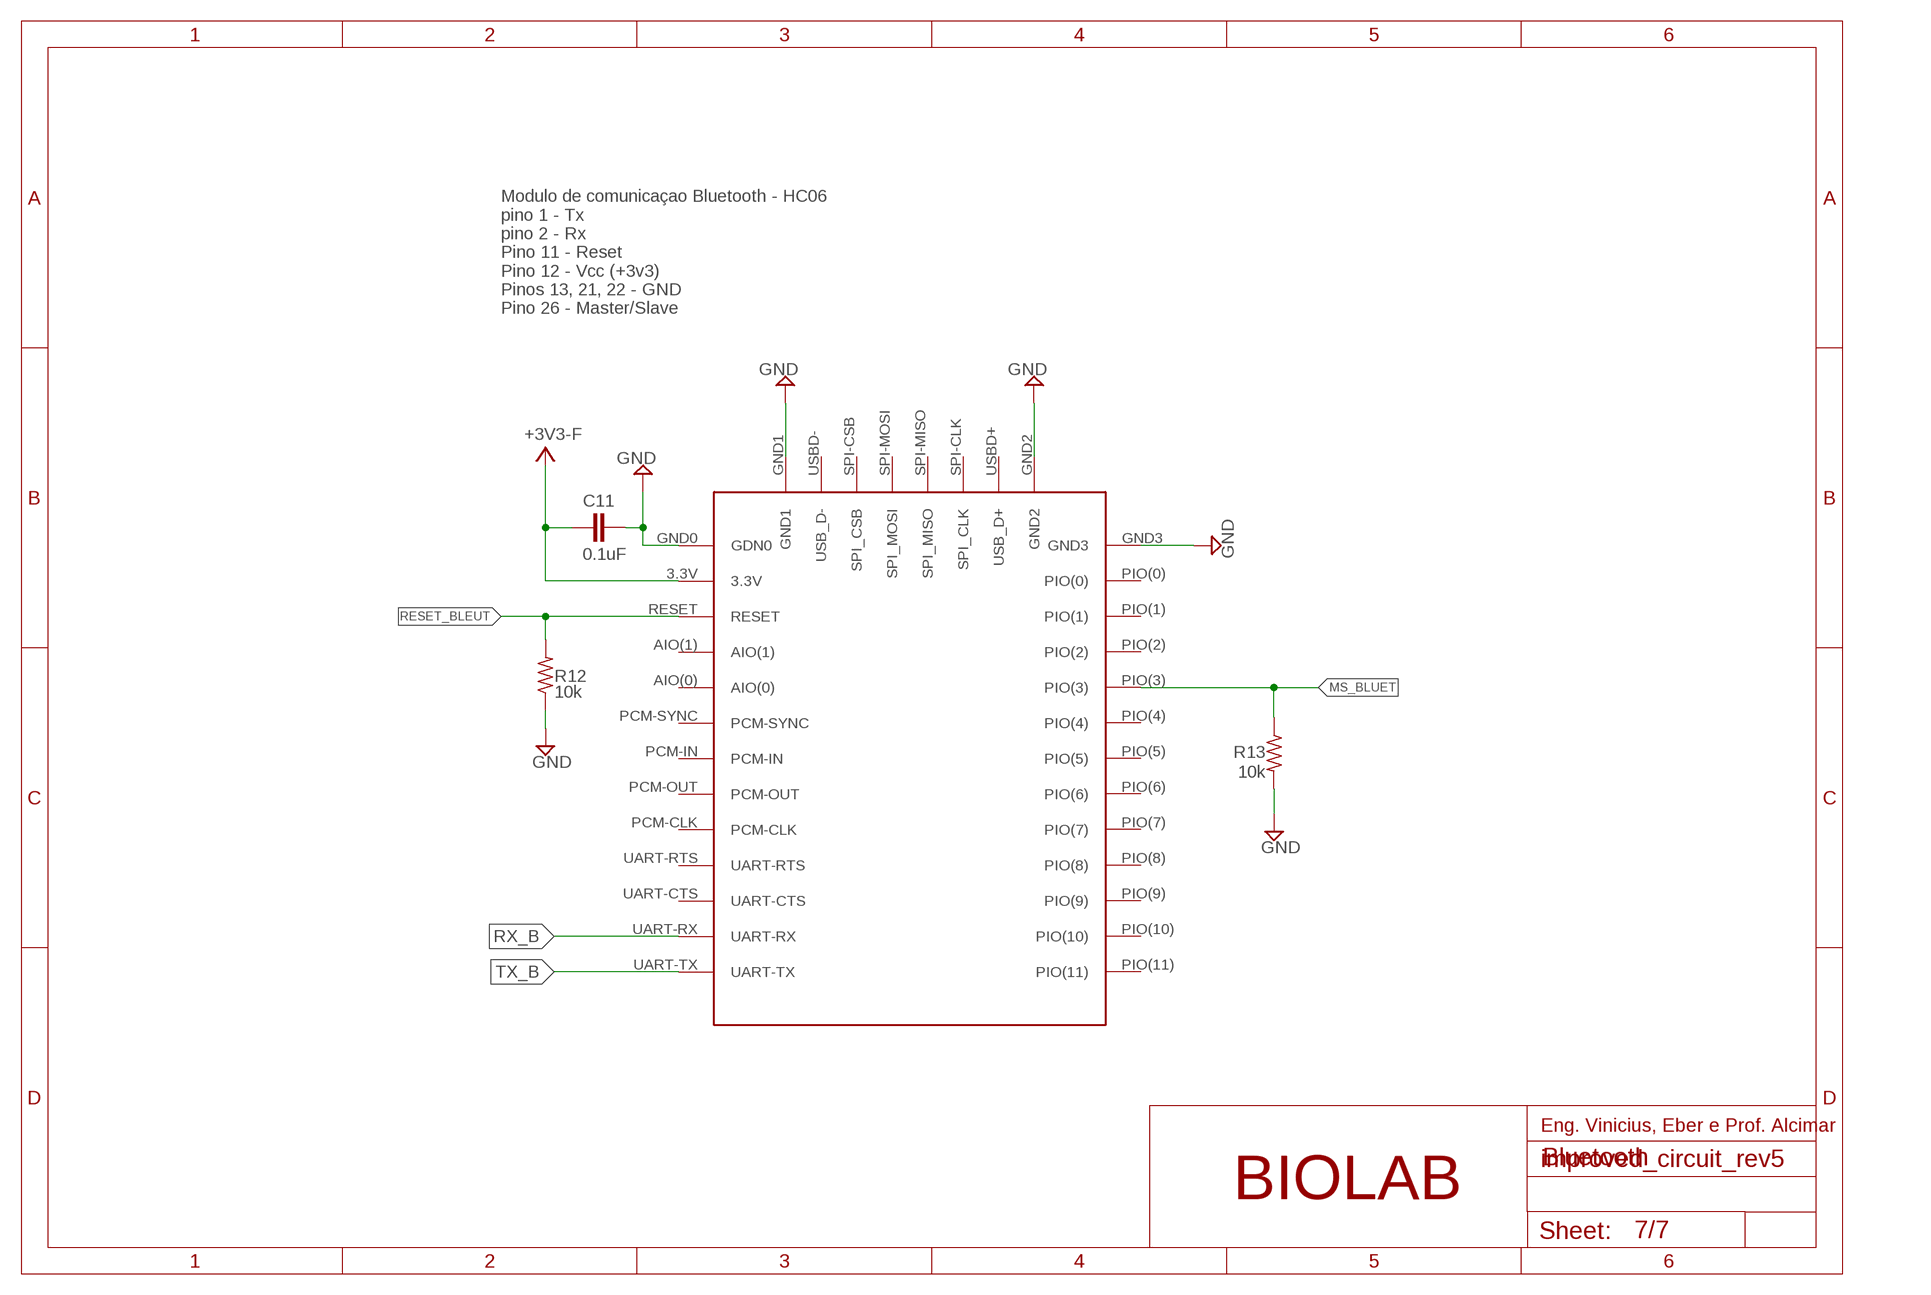
[diagram p6: schematic, sheet 7]

### Parts
C11  0.1uF  CAPACITOR_0805_M  [RESC0805_M]
R12  10k  R-US_M0805  [M0805]
R13  10k  R-US_M0805  [M0805]
U9  MODULE  SKU_80711  [SKU_80711]

### Nets
+3V3: C11.1 U9.3.3V ; supply symbol labelled +3V3-F ; also sheet 1,2,3,5,6
GND: C11.2 R12.1 R13.2 U9.GND0(GDN0) U9.GND1 U9.GND2 U9.GND3 ; also sheet 1,2,3,4,5,6
MS_BLUET: R13.1 U9.PIO(3)
RESET_BLEUT: R12.2 U9.RESET
RX_B: U9.UART-RX
TX_B: U9.UART-TX
Unconnected: U9.AIO(0) U9.AIO(1) U9.PCM-CLK U9.PCM-IN U9.PCM-OUT U9.PCM-SYNC U9.PIO(0) U9.PIO(1) U9.PIO(2) U9.PIO(4) U9.PIO(5) U9.PIO(6) U9.PIO(7) U9.PIO(8) U9.PIO(9) U9.PIO(10) U9.PIO(11) U9.SPI-CLK(SPI_CLK) U9.SPI-CSB(SPI_CSB) U9.SPI-MISO(SPI_MISO) U9.SPI-MOSI(SPI_MOSI) U9.UART-CTS U9.UART-RTS U9.USBD+(USB_D+) U9.USBD-(USB_D-)

### Notes on the sheet
- Modulo de comunicaçao Bluetooth - HC06
  pino 1 - Tx
  pino 2 - Rx 
  Pino 11 - Reset
  Pino 12 - Vcc (+3v3)
  Pinos 13, 21, 22 - GND
  Pino 26 - Master/Slave
- Eng. Vinicius, Eber e Prof. Alcimar
- Bluetooth
- BIOLAB

## Library data of the parts
C1-C3 C6-C15 C20 C21 C23-C27 C30-C32 C34 C35 = Nordic_nRF:CAPACITOR: Generic chip capacitor
C16 C17 = rcl:C-EU: CAPACITOR, European symbol; SPICEPREFIX: C
D1 D3 = diode:BAT60J: Schottky barrier diode Source: www.st.com, BAT60J.pdf
D2 = BAS70W_115:BAS70W,115: General-purpose Schottky diode General-purpose Schottky diodes in small Surface-Mounted Device (SMD) plastic packages. AAL Eindhoven MK; AVAILABILITY: Unavailable; DESCRIPTION: Diode Schottky 70V 70mA _DC_ Surface Mount SC-70; MF: Nexperia USA; MP: BAS70W,115; PACKAGE: SOT-323 NXP Semiconductors; PRICE: None
D33 = SparkFun-DiscreteSemi:DIODE-ZENER: Zener Diode A Zener diode allows current to flow from its anode to its cathode like a normal semiconductor diode, but it also permits current to flow in the reverse direction when its "Zener voltage" is reached. - WIkipedia; PROD_ID: DIO-08199; VALUE: 3.6V
J1-J4 J7 = Headers:61300611121: CONN HEADER VERT 6POS 2.54MM Manufacturer's datasheet <https://katalog.we-online.de/em/datasheet/6130xx11121.pdf>; CREATED_BY: PCBLayout.com; DIGI_KEY_PART_NUMBER: 732-5319-ND; MANUFACTURER: Wurth Electronics Inc.; MPN: 61300611121
J5 J6 J10 = SparkFun-Connectors:CONN_02: Multi connection point. Often used as Generic Header-pin footprint for 0.1 inch spaced/style header connections On any of the 0.1 inch spaced packages, you can populate with these: Break Away Headers - Straight <https://www.sparkfun.com/products/116> (PRT-00116) Break Away Male Headers - Right Angle <https://www.sparkfun.com/products/553> (PRT-00553) Female Headers <https://www.sparkfun.com/products/115> (PRT-00115) Break Away Headers - Machine Pin <https://www.sparkfun.com/products/117> (PRT-00117) Break Away Female Headers - Swiss Machine Pin <https://www.sparkfun.com/products/743> (PRT-00743) For SCREWTERMINALS and SPRING TERMINALS visit here: Screw Terimnals on SparkFun.com <https://www.sparkfun.com/search/results?term=Screw+Terminals> (5mm/3.5mm/2.54mm spacing) This device is also useful as a general connection point to wire up your design to another part of your project. Our various solder wires solder well into these plated through hole pads. Hook-Up Wire - Assortment (Stranded, 22 AWG) <https://www.sparkfun.com/products/11375> (PRT-11375) Hook-Up Wire - Assortment (Solid Core, 22 AWG) <https://www.sparkfun.com/products/11367> (PRT-11367) View the entire wire category on our website here <https://www.sparkfun.com/categories/141> Special notes: Molex polarized connector foot print use with: PRT-08233 with associated crimp pins and housings. 2.54_SCREWTERM for use with PRT-10571. 3.5mm Screw Terminal footprints for PRT-08084 5mm Screw Terminal footprints for use with PRT-08432; PROD_ID: CONN-11443
J8 = SparkFun-Connectors:CONN_04: Multi connection point. Often used as Generic Header-pin footprint for 0.1 inch spaced/style header connections On any of the 0.1 inch spaced packages, you can populate with these: Break Away Headers - Straight <https://www.sparkfun.com/products/116> (PRT-00116) Break Away Male Headers - Right Angle <https://www.sparkfun.com/products/553> (PRT-00553) Female Headers <https://www.sparkfun.com/products/115> (PRT-00115) Break Away Headers - Machine Pin <https://www.sparkfun.com/products/117> (PRT-00117) Break Away Female Headers - Swiss Machine Pin <https://www.sparkfun.com/products/743> (PRT-00743) For SCREWTERMINALS and SPRING TERMINALS visit here: Screw Terimnals on SparkFun.com <https://www.sparkfun.com/search/results?term=Screw+Terminals> (5mm/3.5mm/2.54mm spacing) This device is also useful as a general connection point to wire up your design to another part of your project. Our various solder wires solder well into these plated through hole pads. Hook-Up Wire - Assortment (Stranded, 22 AWG) <https://www.sparkfun.com/products/11375> (PRT-11375) Hook-Up Wire - Assortment (Solid Core, 22 AWG) <https://www.sparkfun.com/products/11367> (PRT-11367) View the entire wire category on our website here <https://www.sparkfun.com/categories/141> Special notes: Molex polarized connector foot print use with SKU : PRT-08231 with associated crimp pins and housings. 1MM SMD Version SKU: PRT-10208; PROD_ID: CONN-10310; SF_ID: PRT-10208
J9 = SparkFun-Connectors:CONN_06: Multi connection point. Often used as Generic Header-pin footprint for 0.1 inch spaced/style header connections On any of the 0.1 inch spaced packages, you can populate with these: Break Away Headers - Straight <https://www.sparkfun.com/products/116> (PRT-00116) Break Away Male Headers - Right Angle <https://www.sparkfun.com/products/553> (PRT-00553) Female Headers <https://www.sparkfun.com/products/115> (PRT-00115) Break Away Headers - Machine Pin <https://www.sparkfun.com/products/117> (PRT-00117) Break Away Female Headers - Swiss Machine Pin <https://www.sparkfun.com/products/743> (PRT-00743) Arduino Stackable Header - 6 Pin <https://www.sparkfun.com/products/9280> (PRT-09280) For SCREWTERMINALS and SPRING TERMINALS visit here: Screw Terimnals on SparkFun.com <https://www.sparkfun.com/search/results?term=Screw+Terminals> (5mm/3.5mm/2.54mm spacing) This device is also useful as a general connection point to wire up your design to another part of your project. Our various solder wires solder well into these plated through hole pads. Hook-Up Wire - Assortment (Stranded, 22 AWG) <https://www.sparkfun.com/products/11375> (PRT-11375) Hook-Up Wire - Assortment (Solid Core, 22 AWG) <https://www.sparkfun.com/products/11367> (PRT-11367) View the entire wire category on our website here <https://www.sparkfun.com/categories/141>; PROD_ID: CONN-08249; SF_ID: GPS-00579
L1 L3 = BeagleBone_Blue_R3:INDUCTOR: Inductors Basic Inductor/Choke - 0603 and 1206. Footprints are not proven and vary greatly between part numbers. SRN6045- 33uH, 20% 1.4A
Q1 = zetex:ZXMD63N03X: DUAL 30V N-CHANNEL ENHANCEMENT MODE MOSFET Source: Data sheet <http://www.diodes.com/datasheets/ZXMD63N03X.pdf>; OC_FARNELL: unknown; OC_NEWARK: unknown
Q2 Q3 Q7 = FDV303N:FDV303N: Digital FET, N-Channel; AVAILABILITY: Unavailable; DESCRIPTION: FD V303N Series N-Channel 25 V 0.45 Ohm Surface Mount Digital FET - SOT-23-3; MF: Fairchild Semiconductor; MP: FDV303N.; PACKAGE: SOT-23-3 Fairchild Semiconductor; PRICE: None
Q4 Q5 = transistor-power:FDN360P: Single P-Channel, PowerTrench (R) MOSFET Source: http://www.fairchildsemi.com/ds/FD/FDN360P.pdf
Q9 = FDS6675BZ:FDS6675: P-Channel MOSFET Logic Level, PowerTrenchTM; AVAILABILITY: Unavailable; DESCRIPTION: P-Channel 30 V 14 mOhm Logic Level PowerTrench Mosfet - SOIC-8; MF: ON Semiconductor; MP: FDS6675; PACKAGE: SOIC-8 Fairchild Semiconductor; PRICE: None
Q88 = m-pad-2.1:BSS84LT1: OnSemi's BSS84LT1 Power MOSFET 130 mA, 50 V RDS(on) = 10 P-Channel SOT-23 Description: These miniature surface mount MOSFETs reduce power loss conserve energy, making this device ideal for use in small power management circuitry. Typical applications are DC/DC converters, load switching, power management in portable and battery-powered products such as computers, printers, cellular and cordless telephones. Features: Energy Efficient Miniature SOT-23 Surface Mount Package Saves Board Space Pb-Free Package is Available Please send any comments to: messi@users.sourceforge.net
R1-R10 R12 R13 R18 R26-R44 R46 R49-R51 R54-R58 = BeagleBone_Black_Wireless:R-US_: RESISTOR, American symbol
U1 = TPS62110RSAT:TPS62110RSAT
U2 = allegro:A3906: Low Voltage Stepper and Single/Dual DC Motor Driver Data Sheet <http://www.allegromicro.com/en/Products/Part_Numbers/3906/3906.pdf>
U3 = ADUM1250:ADUM1250: Hot Swappable, Dual I2C Isolators Source: http://www.analog.com/static/imported-files/data_sheets/ADUM1250_1251.pdf; AVAILABILITY: Unavailable; DESCRIPTION: I²C Digital Isolator 2500Vrms 2 Channel 1Mbps 25kV/µs CMTI 8-SOIC _0.154, 3.90mm Width_; MF: Analog Devices; MP: ADUM1250; PACKAGE: SOIC-8 Analog Devices; PRICE: None
U4 = DSPIC33FJ128MC804-I_PT:DSPIC33FJ128MC804-I/PT: Digital Signal Controllers; AVAILABILITY: Unavailable; DESCRIPTION: dsPIC dsPIC™ 33F Microcontroller IC 16-Bit 40 MIPs 128KB _128K x 8_ FLASH 44-TQFP _10x10_; MF: Microchip; MP: DSPIC33FJ128MC804-I/PT; PACKAGE: TQFP-44 Microchip; PRICE: None
U5 = analog-devices:AD8067: High Gain Bandwidth, Precision Fast FET(TM) Op Amp Source: http://www.analog.com/UploadedFiles/Data_Sheets/346131962AD8067_a.pdf; MF: ALTERA CORPORATION; MPN: AD8067ARTZ-REEL7; OC_FARNELL: 1464848; OC_NEWARK: 59K6326
U6 = LM2902:LM2902
U7 U8 = v-reg-micrel:MIC5219BM5: VOLTAGE REGULATOR; MF: ALTERA CORPORATION; MPN: MIC5219BM5 TR; OC_FARNELL: 1100656; OC_NEWARK: 09J8939
U9 = Bluetooth_serial:SKU_80711